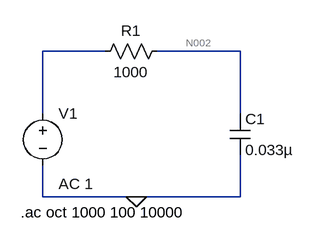
[diagram p0: schematic Draft12.asc]
Draft12.asc, the LTspice schematic file:
Version 4
SHEET 1 880 680
WIRE 32 48 -64 48
WIRE 240 48 112 48
WIRE -64 144 -64 48
WIRE 240 144 240 48
WIRE -64 272 -64 224
WIRE 80 272 -64 272
WIRE 240 272 240 208
WIRE 240 272 80 272
FLAG 80 272 0
SYMBOL voltage -64 128 R0
WINDOW 123 24 124 Left 2
WINDOW 39 0 0 Left 2
SYMATTR InstName V1
SYMATTR Value ""
SYMATTR Value2 AC 1
SYMBOL res 128 32 R90
WINDOW 0 0 56 VBottom 2
WINDOW 3 32 56 VTop 2
SYMATTR InstName R1
SYMATTR Value 1000
SYMBOL cap 224 144 R0
SYMATTR InstName C1
SYMATTR Value 0.033µ
TEXT -98 296 Left 2 !.ac oct 1000 100 10000

The netlist it stands for:
* Draft12.asc
V1 N001 0 AC 1
R1 N002 N001 1000
C1 N002 0 0.033µ
.ac oct 1000 100 10000
.backanno
.end

* Results of the author's LTspice run, read from the files saved beside the schematic
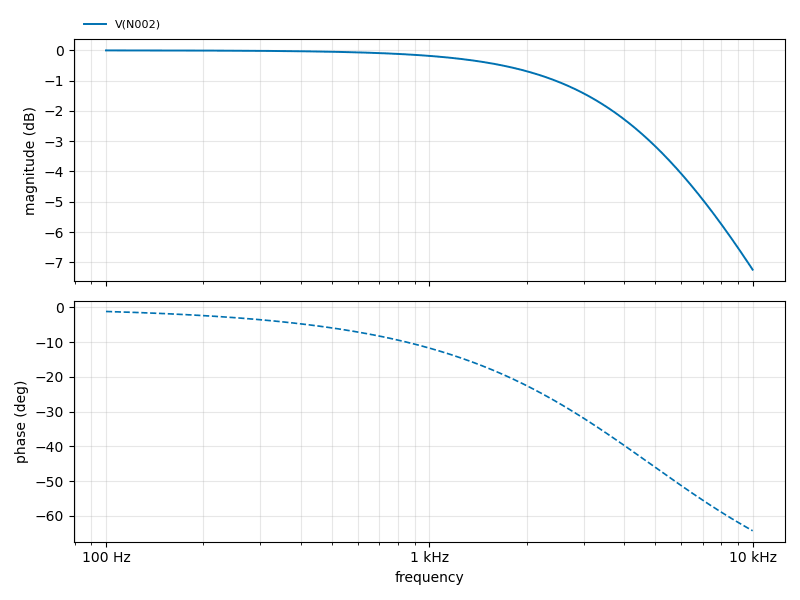
[diagram p1: AC Analysis of Draft12.asc, plotted from the saved traces]
* AC Analysis, 1 run:
*   V(N002): -0.00 dB at 100 Hz, -7.24 dB at 10 kHz, peak -0.00 dB at 100 Hz, 3 dB below the peak at 4.825 kHz